# Altium schematic sheet power.SchDoc
size A4; SheetNumber: 5; SheetTotal: 6
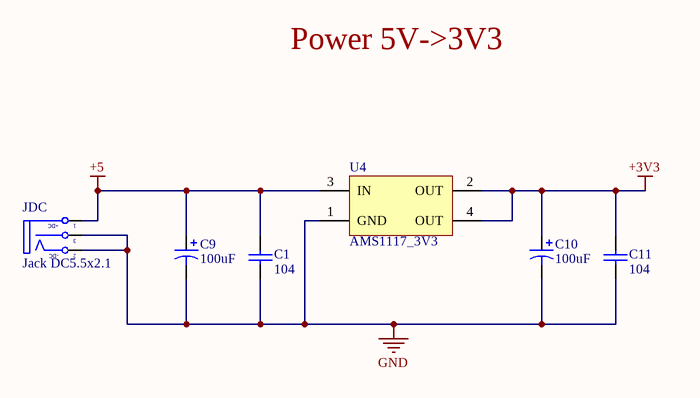
[diagram p0: power.SchDoc]

## Parts
C1  104  [0805]
C9  value 100uF  [CAP_ALUMINUM_SMD_SIZE_D]  (hidden comment: Cap Polar)
C10  value 100uF  [CAP_ALUMINUM_SMD_SIZE_D]  (hidden comment: Cap Polar)
C11  104  [0805]
JDC  Jack DC5.5x2.1  [DC-IN]
U4  AMS1117_3V3  [SOT223-4M]

## Nets
+3V3: C10.1 C11.2 U4.2(OUT) U4.4(OUT)
+5: C1.2 C9.1 JDC.1(T) U4.3(IN)
GND: C1.1 C9.2 C10.2 C11.1 JDC.2(TN) JDC.3(S) U4.1(GND)

## Notes on the sheet
- Power 5V->3V3
- (in symbol Jac_DC) +DC; -DC

## Library data of the parts
C1 C11 = Cap 104_SMD: Capacitor (Semiconductor SIM Model); Value: 0.1uF; Published: 8-Jun-2000; LatestRevisionDate: 17-Jul-2002; LatestRevisionNote: Re-released for DXP Platform.; PackageReference: C1206; Publisher: Altium Limited
C9 C10 = Cap Polar: Polarized Capacitor; Published: 8-Jun-2000; LatestRevisionDate: 17-Jul-2002; LatestRevisionNote: Re-released for DXP Platform.; PackageReference: POLAR0.8; Publisher: Altium Limited
JDC = Jac_DC: Cắm; Ten_Linh_Kien: Jack DC5.5x2.1MM DC5501; Ma_Hang: MH000923; Don_Vi: Con; Kieu_Chan: *; Ghi_Chu: *; Chung_Loai: Cắm
U4 = AMS1117_3V3: 1A Regulator